# Altium project ArcadeTestHAT 05.PrjPCB (part 2 of 2)

## Sheet ArcadeTestHAT 05 Pi interface.SchDoc: R Pi interface circuitry
size A3; DrawnBy: Steve Hodges; DocumentNumber: 1; Revision: 1.2; SheetNumber: 1; SheetTotal: 2; VersionControl_RevNumber: 1
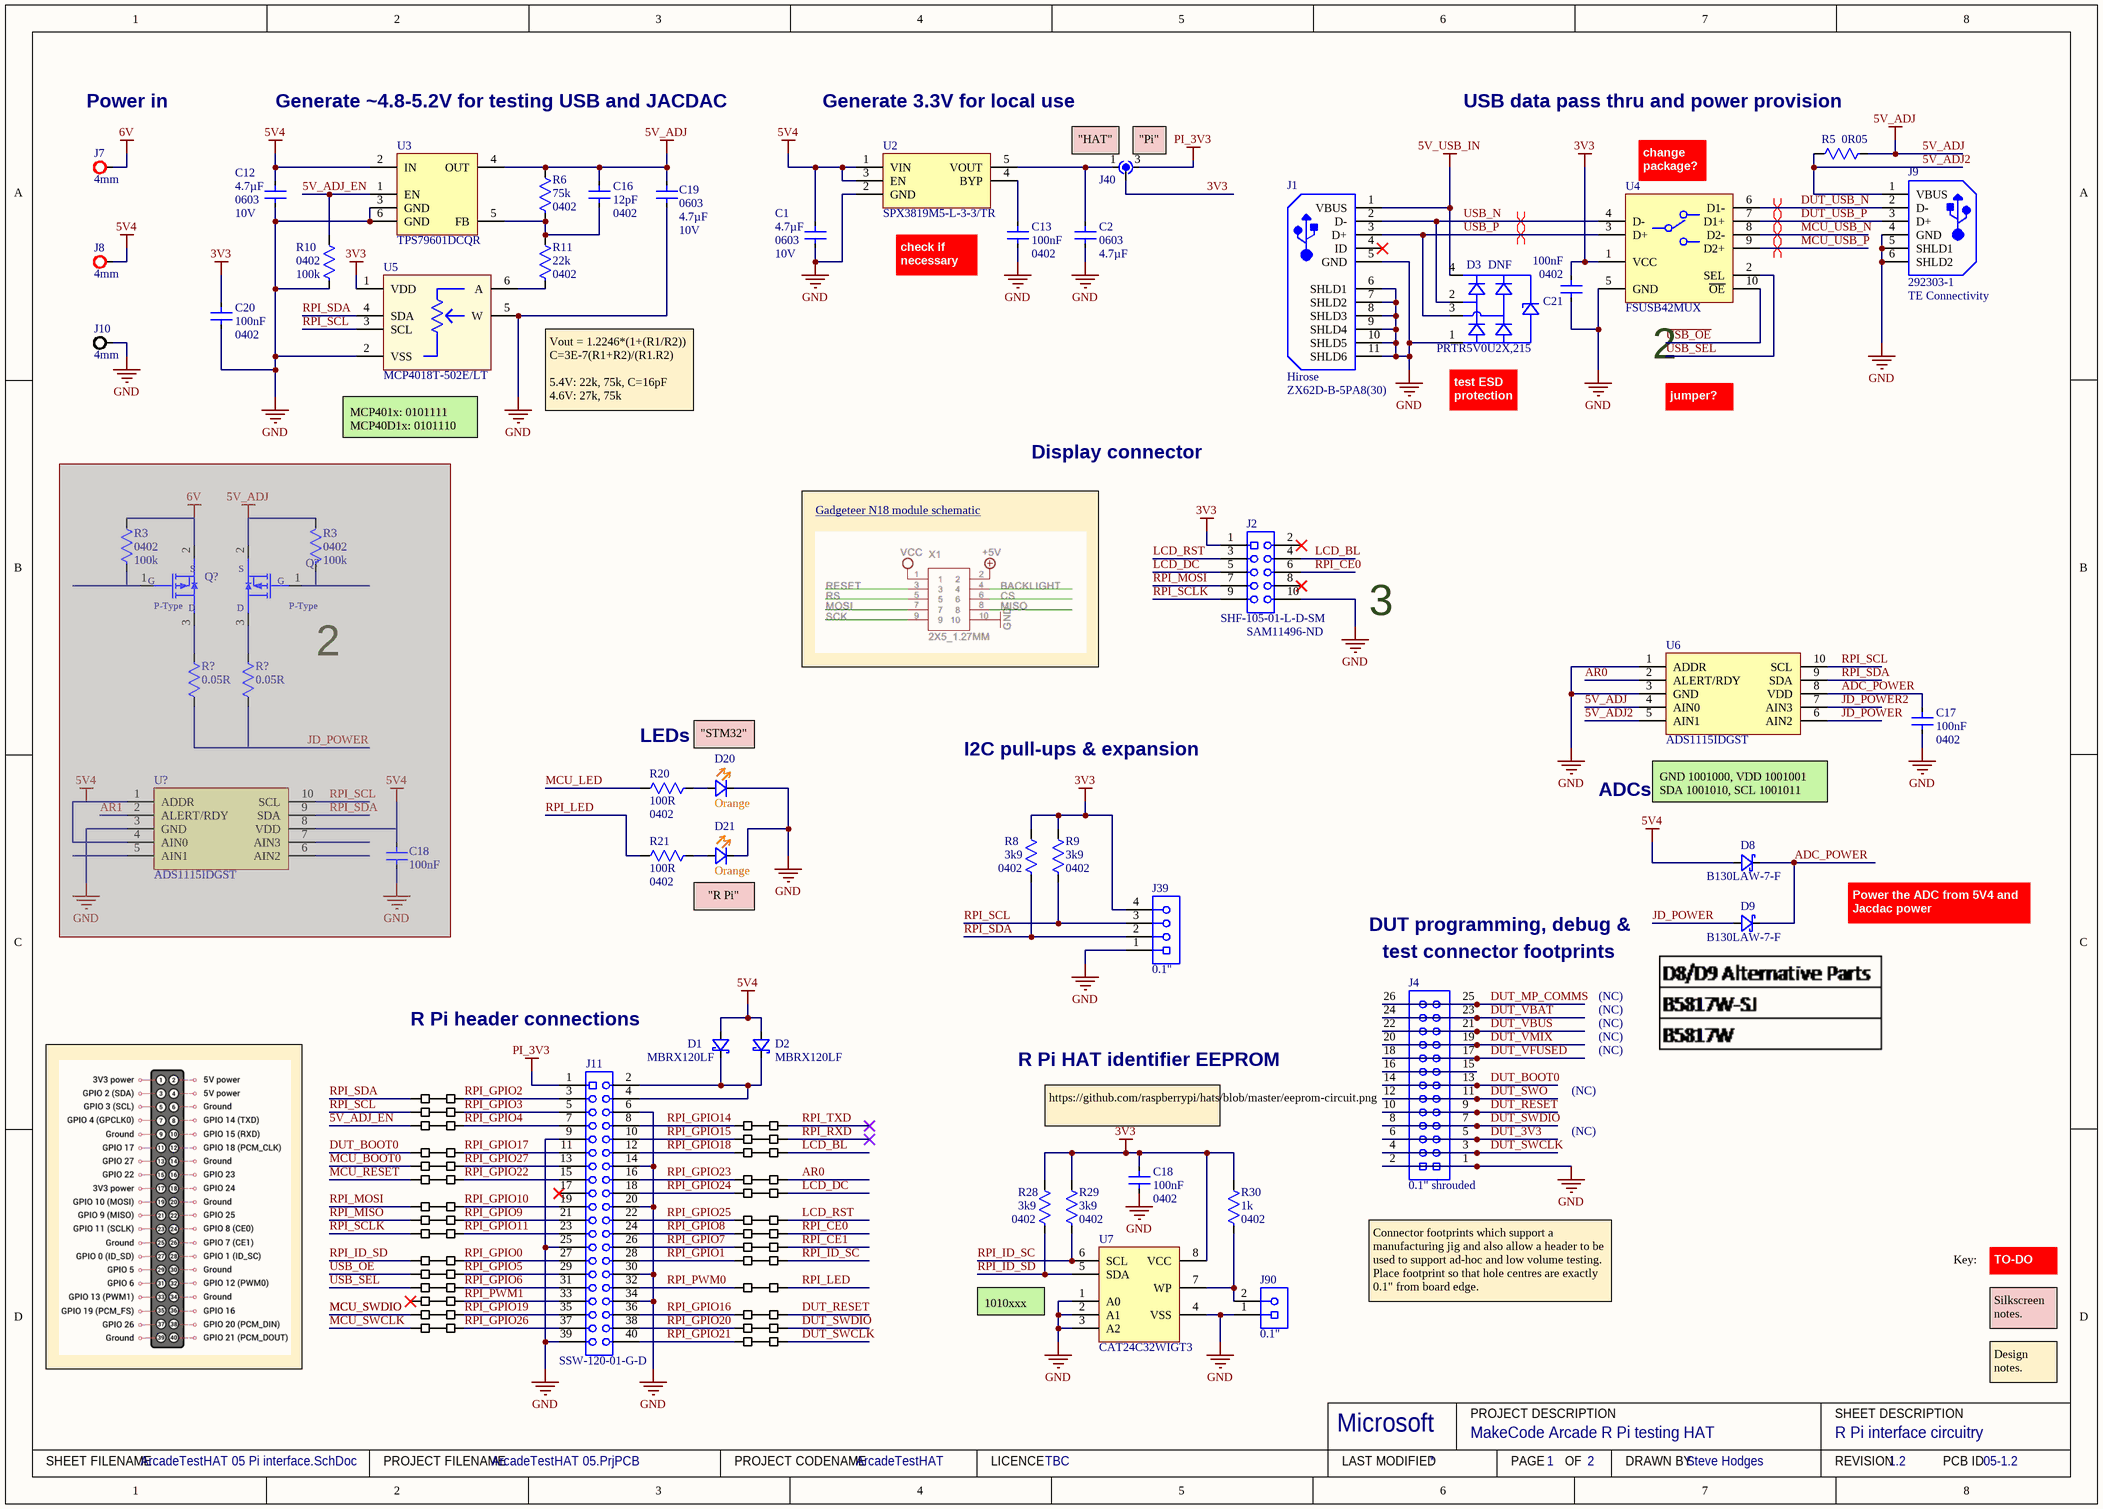
[diagram p1: ArcadeTestHAT 05 Pi interface.SchDoc]

### Parts
(Parts that share a designator on the sheet are numbered #1, #2 ... from top to bottom, then left to right.)
C1  Case/Package: 0603  Capacitance: 4.7µF  Voltage Rating: 10V  [CAP 0603 (1608) x 1.2mm]  (hidden comment: CL10A475KP8NNNC)
C2  Case/Package: 0603  Capacitance: 4.7µF  [CAP 0603 (1608) x 1.2mm]  (hidden comment: CL10A475KP8NNNC)
C12  Case/Package: 0603  Capacitance: 4.7µF  Voltage Rating: 10V  [CAP 0603 (1608) x 1.2mm]  (hidden comment: CL10A475KP8NNNC)
C13  Case/Package: 0402  Capacitance: 100nF  [CAP0402]  (hidden comment: 0402YG104ZAT2A)
C16  value 12pF  Package Size: 0402  [CAP0402]  (hidden comment: CAP0402_GENERIC 12pF)
C17  Case/Package: 0402  Capacitance: 100nF  [CAP0402]  (hidden comment: 0402YG104ZAT2A)
C18#1  100nF  [TDK 2010]  (masked out: inside a compile mask, not in the netlist)
C18#2  Case/Package: 0402  Capacitance: 100nF  [CAP0402]  (hidden comment: 0402YG104ZAT2A)
C19  Case/Package: 0603  Capacitance: 4.7µF  Voltage Rating: 10V  [CAP 0603 (1608) x 1.2mm]  (hidden comment: CL10A475KP8NNNC)
C20  Case/Package: 0402  Capacitance: 100nF  [CAP0402]  (hidden comment: 0402YG104ZAT2A)
C21  Case/Package: 0402  Capacitance: 100nF  [CAP0402]  (hidden comment: 0402YG104ZAT2A)
D1  MBRX120LF  [MCC SOD-123]
D2  MBRX120LF  [MCC SOD-123]
D3  DNF  Manufacturer Part Number: PRTR5V0U2X,215  [NXP-SOT143B-4_V]  (no BOM)
D8  B130LAW-7-F  [SOD-123]
D9  B130LAW-7-F  [SOD-123]
D20  Colour: Orange  [Rohm SML-D12 Orange]  (hidden comment: SML-D12D)
D21  Colour: Orange  [Rohm SML-D12 Orange]  (hidden comment: SML-D12D)
J1  Manufacturer: Hirose  Manufacturer Part Number: ZX62D-B-5PA8(30)  [HIRO-ZX62D-B-5PA8_V-noslots]  (hidden comment: ZX62D-B-5PA8(30)-whitesch)
J2  Manufacturer Part Number: SHF-105-01-L-D-SM  Supplier Part Number 6: SAM11496-ND  [Samtec SHF-105-01-L-D-SM - Updated silkscreen]  (hidden comment: SHF-105-01-L-D-SM-whitesch)
J4  0.1" shrouded  [Generic 2x13 2.54mm header shrouded - Alternative]
J5  0603-SHORT  [0603-WITH-SHORT]  (value not drawn)  (net tie, no BOM)
J7  4mm  [4mm post red]
J8  4mm  [4mm post red]
J9  Manufacturer Part Number: 292303-1  Manufacturer: TE Connectivity  [TE-292303-1_V - MH with enlarged annular ring]  (hidden comment: TE-292303)
J10  4mm  [4mm post black]
J11  SSW-120-01-G-D  [SAMTEC-SSW-120-01-G-D]
J12  0603-SHORT  [0603-WITH-SHORT]  (value not drawn)  (net tie, no BOM)
J13  0603-SHORT  [0603-WITH-SHORT]  (value not drawn)  (net tie, no BOM)
J14  0603-SHORT  [0603-WITH-SHORT]  (value not drawn)  (net tie, no BOM)
J15  0603-SHORT  [0603-WITH-SHORT]  (value not drawn)  (net tie, no BOM)
J16  0603-SHORT  [0603-WITH-SHORT]  (value not drawn)  (net tie, no BOM)
J17  0603-SHORT  [0603-WITH-SHORT]  (value not drawn)  (net tie, no BOM)
J18  0603-SHORT  [0603-WITH-SHORT]  (value not drawn)  (net tie, no BOM)
J19  0603-SHORT  [0603-WITH-SHORT]  (value not drawn)  (net tie, no BOM)
J20  0603-SHORT  [0603-WITH-SHORT]  (value not drawn)  (net tie, no BOM)
J21  0603-SHORT  [0603-WITH-SHORT]  (value not drawn)  (net tie, no BOM)
J22  0603-SHORT  [0603-WITH-SHORT]  (value not drawn)  (net tie, no BOM)
J23  0603-SHORT  [0603-WITH-SHORT]  (value not drawn)  (net tie, no BOM)
J24  0603-SHORT  [0603-WITH-SHORT]  (value not drawn)  (net tie, no BOM)
J25  0603-SHORT  [0603-WITH-SHORT]  (value not drawn)  (net tie, no BOM)
J26  0603-SHORT  [0603-WITH-SHORT]  (value not drawn)  (net tie, no BOM)
J27  0603-SHORT  [0603-WITH-SHORT]  (value not drawn)  (net tie, no BOM)
J28  0603-SHORT  [0603-WITH-SHORT]  (value not drawn)  (net tie, no BOM)
J29  0603-SHORT  [0603-WITH-SHORT]  (value not drawn)  (net tie, no BOM)
J30  0603-SHORT  [0603-WITH-SHORT]  (value not drawn)  (net tie, no BOM)
J31  0603-SHORT  [0603-WITH-SHORT]  (value not drawn)  (net tie, no BOM)
J32  0603-SHORT  [0603-WITH-SHORT]  (value not drawn)  (net tie, no BOM)
J33  0603-SHORT  [0603-WITH-SHORT]  (value not drawn)  (net tie, no BOM)
J34  0603-SHORT  [0603-WITH-SHORT]  (value not drawn)  (net tie, no BOM)
J35  0603-SHORT  [0603-WITH-SHORT]  (value not drawn)  (net tie, no BOM)
J36  0603-SHORT  [0603-WITH-SHORT]  (value not drawn)  (net tie, no BOM)
J37  0603-SHORT  [0603-WITH-SHORT]  (value not drawn)  (net tie, no BOM)
J38  0603-SHORT  [0603-WITH-SHORT]  (value not drawn)  (net tie, no BOM)
J39  0.1"  [Generic 1x4 2.54mm header]
J40  Three way open solder blob  [ThreeWaySolderBlob]  (value not drawn)  (no BOM)
J90  0.1"  [Generic 1x2 2.54mm header]
Q?#1  MOSFET P-CH 20V 4.2A SOT23  [DIODES-SOT23-3]  (value not drawn)  (masked out: inside a compile mask, not in the netlist)
Q?#2  MOSFET P-CH 20V 4.2A SOT23  [DIODES-SOT23-3]  (value not drawn)  (masked out: inside a compile mask, not in the netlist)
R3#2  Case Code (Imperial): 0402  Resistance: 100k  [RES0402]  (hidden comment: MCWR04X1003FTL)  (masked out: inside a compile mask, not in the netlist)
R3#3  Case Code (Imperial): 0402  Resistance: 100k  [RES0402]  (hidden comment: MCWR04X1003FTL)  (masked out: inside a compile mask, not in the netlist)
R5  value 0R05  [RES1206]  (hidden comment: KDV12FR050ET)
R6  Case: 0402  [RES0402]  (hidden comment: 75k)
R8  Case: 0402  [RES0402]  (hidden comment: 3k9)
R9  Case: 0402  [RES0402]  (hidden comment: 3k9)
R10  Case Code (Imperial): 0402  Resistance: 100k  [RES0402]  (hidden comment: MCWR04X1003FTL)
R11  Case: 0402  [RES0402]  (hidden comment: 22k)
R20  value 100R  Case: 0402  [RES0402]  (hidden comment: RES0402_GENERIC 100R)
R21  value 100R  Case: 0402  [RES0402]  (hidden comment: RES0402_GENERIC 100R)
R28  Case: 0402  [RES0402]  (hidden comment: 3k9)
R29  Case: 0402  [RES0402]  (hidden comment: 3k9)
R30  Case: 0402  [RES0402]  (hidden comment: 1k)
R?#3  value 0.05R  [RES1206]  (hidden comment: RES1206_GENERIC)  (masked out: inside a compile mask, not in the netlist)
R?#4  value 0.05R  [RES1206]  (hidden comment: RES1206_GENERIC)  (masked out: inside a compile mask, not in the netlist)
U2  Manufacturer Part Number: SPX3819M5-L-3-3/TR  [MaxLinear-SOT95P280X145-5N]  (hidden comment: SPX3819M5-L-3-3_TR)
U3  TPS79601DCQR  [TPS79633DCQR]
U4  FSUSB42MUX  [ON_SEMI-MSOP-10]
U5  MCP4018T-502E/LT  [MICROCHIP-SC70-6 - MAX]
U6  ADS1115IDGST  [ADS1115IDGST]
U7  Manufacturer Part Number: CAT24C32WIGT3  [ONSC-SOIC-8-751BD-01_L]  (hidden comment: CAT24C32WI-GT3)
U?  ADS1115IDGST  [ADS1115IDGST]  (masked out: inside a compile mask, not in the netlist)

### Nets
3V3: C18#2.2 C20.2 C21.2 J2.1 J39.4 J40.2 R8.1 R9.1 R28.1 R29.1 R30.1 U4.1(VCC) U5.1(VDD) U7.8(VCC)
5V4: C1.2 C12.2 D1.2(A) D2.2(A) D8.2(A) J8.1 U2.1(VIN) U2.3(EN) U3.2(IN)
5V_ADJ: C16.2 C19.2 R5.2 R6.1 U3.4(OUT) U6.4(AIN0)
5V_USB_IN: D3.4(VCC) J1.1(VBUS)
6V: J7.1
GND: C1.1 C2.1 C12.1 C13.1 C17.1 C18#2.1 C19.1 C20.1 C21.1 D3.1(GND) D20.1(K) D21.1(K) J1.5(GND) J1.6(SHLD1) J1.7(SHLD2) J1.8(SHLD3) J1.9(SHLD4) J1.10(SHLD5) J1.11(SHLD6) J2.10 J4.1 J4.2 J9.4(GND) J9.5(SHLD1) J9.6(SHLD2) J10.1 J11.6 J11.9 J11.14 J11.20 J11.25 J11.30 J11.34 J11.39 J39.1 J90.1 R10.2 U2.2(GND) U3.3(GND) U3.6(GND) U4.5(GND) U5.2(VSS) U5.5(W) U6.1(ADDR) U6.3(GND) U7.1(A0) U7.2(A1) U7.3(A2) U7.4(VSS)
PI_3V3: J11.1 J40.3
5V_ADJ2: J9.1(VBUS) R5.1 U6.5(AIN1)
5V_ADJ_EN: J13.2 R10.1 U3.1(EN)
~{USB_OE}: J30.2 U4.10(~{OE})
ADC_POWER: C17.2 D8.1(K) D9.1(K) U6.8(VDD)
AR0: J20.2 U6.2(ALERT/RDY)
DUT_3V3: J4.5 J4.6
DUT_BOOT0: J4.13 J4.14 J16.2
DUT_MP_COMMS: J4.25 J4.26
DUT_RESET: J4.9 J4.10 J35.2
DUT_SWCLK: J4.3 J4.4 J38.2
DUT_SWDIO: J4.7 J4.8 J37.2
DUT_SWO: J4.11 J4.12
DUT_USB_N: J9.2(D-) U4.6(D1-)
DUT_USB_P: J9.3(D+) U4.7(D1+)
DUT_VBAT: J4.23 J4.24
DUT_VBUS: J4.21 J4.22
DUT_VFUSED: J4.17 J4.18
DUT_VMIX: J4.19 J4.20
JD_POWER: D9.2(A) U6.6(AIN2)
JD_POWER2: U6.7(AIN3)
LCD_BL: J2.4 J17.2
LCD_DC: J2.5 J21.2
LCD_RST: J2.3 J24.2
MCU_BOOT0: J18.2
MCU_LED: R20.1
MCU_RESET: J19.2
MCU_SWCLK: J36.2
MCU_SWDIO: J34.2
MCU_USB_N: U4.8(D2-)
MCU_USB_P: U4.9(D2+)
RPI_CE0: J2.6 J26.2
RPI_CE1: J27.2
RPI_GPIO0: J11.27 J28.1
RPI_GPIO1: J11.28 J29.1
RPI_GPIO2: J5.1 J11.3
RPI_GPIO3: J11.5 J12.1
RPI_GPIO4: J11.7 J13.1
RPI_GPIO5: J11.29 J30.1
RPI_GPIO6: J11.31 J31.1
RPI_GPIO7: J11.26 J27.1
RPI_GPIO8: J11.24 J26.1
RPI_GPIO9: J11.21 J23.1
RPI_GPIO10: J11.19 J22.1
RPI_GPIO11: J11.23 J25.1
RPI_GPIO14: J11.8 J14.1
RPI_GPIO15: J11.10 J15.1
RPI_GPIO16: J11.36 J35.1
RPI_GPIO17: J11.11 J16.1
RPI_GPIO18: J11.12 J17.1
RPI_GPIO19: J11.35 J34.1
RPI_GPIO20: J11.38 J37.1
RPI_GPIO21: J11.40 J38.1
RPI_GPIO22: J11.15 J19.1
RPI_GPIO23: J11.16 J20.1
RPI_GPIO24: J11.18 J21.1
RPI_GPIO25: J11.22 J24.1
RPI_GPIO26: J11.37 J36.1
RPI_GPIO27: J11.13 J18.1
RPI_ID_SC: J29.2 R29.2 U7.6(SCL)
RPI_ID_SD: J28.2 R28.2 U7.5(SDA)
RPI_LED: J32.2 R21.1
RPI_MISO: J23.2
RPI_MOSI: J2.7 J22.2
RPI_PWM0: J11.32 J32.1
RPI_PWM1: J11.33 J33.1
RPI_RXD: J15.2
RPI_SCL: J12.2 J39.3 R9.2 U5.3(SCL) U6.10(SCL)
RPI_SCLK: J2.9 J25.2
RPI_SDA: J5.2 J39.2 R8.2 U5.4(SDA) U6.9(SDA)
RPI_TXD: J14.2
USB_N: D3.2(I/O1) J1.2(D-) U4.4(D-)
USB_P: D3.3(I/O2) J1.3(D+) U4.3(D+)
USB_SEL: J31.2 U4.2(SEL)
NetC2_2: C2.2 J40.1 U2.5(VOUT)
NetC13_2: C13.2 U2.4(BYP)
NetC16_1: C16.1 R6.2 R11.1 U3.5(FB)
NetD1_1: D1.1(K) D2.1(K) J11.2 J11.4
NetD20_2: D20.2(A) R20.2
NetD21_2: D21.2(A) R21.2
NetJ4_15: J4.15 J4.16
NetJ90_2: J90.2 R30.2 U7.7(WP)
NetR11_2: R11.2 U5.6(A)

Not connected (* = marked no-connect by the designer): J1 4(ID)*; J2 2* 8*; J11 17*; J33 2*

### Layout directives
differential pair: DUT_USB_N, DUT_USB_P, MCU_USB_N, MCU_USB_P, USB_N, USB_P

### Notes on the sheet
- Power in
- Generate ~4.8-5.2V for testing USB and JACDAC
- Generate 3.3V for local use
- (near R5) USB data pass thru and power provision
- (near J40) "HAT"
- (near J40) "Pi"
- (near U4) change package?
- check if necessary
- (near U4) 2
- (near U5) MCP401x: 0101111
  MCP40D1x: 0101110
- Vout = 1.2246*(1+(R1/R2))
  C=3E-7(R1+R2)/(R1.R2)
  5.4V: 22k, 75k, C=16pF
  4.6V: 27k, 75k
- (near D3) test ESD protection
- jumper?
- 5.2V: R2=22k, R1=71k, C=18pF
  4.4V: R2=27k, R1=71k
  4.8V: R2=22k, R1=64k, C=18pF
  5.2V: R2=30k, R1=98k, C=13pF
  4.8V: R2=30k, R1=87k, C=13pF
- Gadgeteer N18 module schematic <http://old.ghielectronics.com/downloads/schematic/Display_N18_Module_SCH.pdf>
- Display connector
- 3
- (near Q?#2) 2
- LEDs
- "STM32"
- I2C pull-ups & expansion
- ADCs
- GND 1001000, VDD 1001001
  SDA 1001010, SCL 1001011
- "R Pi"
- Power the ADC from 5V4 and Jacdac power
- DUT programming, debug &
- (near J4) test connector footprints
- R Pi header connections
- (NC)
- R Pi HAT identifier EEPROM
- https://github.com/raspberrypi/hats/blob/master/eeprom-circuit.png
- 1010xxx
- Connector footprints which support a manufacturing jig and also allow a header to be used to support ad-hoc and low volume testing. Place footprint so that hole centres are exactly 0.1" from board edge.
- Key:
- Silkscreen notes.
- TO-DO
- Design notes.
- Microsoft
- PROJECT DESCRIPTION
- SHEET DESCRIPTION
- SHEET FILENAME
- PROJECT FILENAME
- PROJECT CODENAME
- LICENCE
- LAST MODIFIED
- PAGE
- OF
- DRAWN BY
- REVISION
- PCB ID
- (in symbol DMG2305UX-whitesch) P-Type

### Library data of the parts
C1 C2 C12 C19 = 4.7uF 10V X5R ±10% Samsung CL: Generic 0603 capacitor 4.7uF 10V, e.g. Samsung CL10A475KP8NNNC; Dielectric: X5R; Tolerance: 10%; Created By: shodges; Supplier 1: Digi-Key; Manufacturer: Samsung; Manufacturer Part Number: CL10A475KP8NNNC; Stock 1: 40000; Pricing 1: 1=0.15, 10=0.109, 100=0.0513, 500=0.036, 1000=0.0298 (USD); Mount: Surface Mount; Case Code (Imperial): 0603; Contact Plating: Tin; Min Operating Temperature: -55°C; Max Operating Temperature: 85°C; Package Quantity: 1; Packaging: Tape and Reel; Length: 1.6mm; Height: 0.8mm; Width: 0.031inch; Thickness: 0.035inch; Depth: 0.8mm; Radiation Hardening: No; Supplier Part Number 1: 1276-1044-1-ND; Supplier 2: Farnell; Supplier Part Number 2: 3010071; Case Code (Metric): 1608
  C2: Voltage Rating: 10V
C13 C17 C18#2 C20 C21 = 0402YG104ZAT2A: Generic 0402 capacitor 100nF 16V, e.g. AVX 0402YG104ZAT2A; Manufacturer: Kyocera AVX; Tolerance: 80%; Dielectric: Y5V; Insulation Resistance: 100GR; Dissipation Factor: 9%; Supplier 1: Digi-Key; Manufacturer Part Number: 0402YG104ZAT2A; Stock 1: 0; Pricing 1: 1=0.1, 10=0.041, 100=0.0183, 500=0.01306, 1000=0.01026, 2500=0.00933, 5000=0.00858 (USD); Mount: Surface Mount,PCB; Case Code (Metric): 1005; Case Code (Imperial): 0402; Contact Plating: Tin,Matte; Min Operating Temperature: -30°C; Max Operating Temperature: 85°C; Packaging: Tape and Reel; Voltage Rating (DC): 16V; Termination: SMD/SMT; Voltage: 16V; Package Quantity: 1; Voltage Rating: 16V; Length: 1mm; Height: 0.5mm; Depth: 0.5mm; Width: 0.02inch; Thickness: 0.022inch; Radiation Hardening: No; REACH SVHC: No SVHC; Lead Free: Lead Free; ComponentLink2URL: http://datasheets.avx.com/Y5V.pdf; ComponentLink2Description: AVX datasheet online; Supplier 2: Farnell; Supplier 3: Mouser; Supplier 4: RSComponents; Supplier Part Number 1: 478-1138-1-ND; Supplier Part Number 2: 1327667; Supplier Part Number 3: 581-040216G104Z; Supplier Part Number 4: 698-3190
C16 = CAP0402_GENERIC: Generic 0402 capacitor 12pF; Rated Voltage: * V; Manufacturer: Generic
C18#1 = 100nF 0201 10V: CAP CER 0.1UF 10V X5R 0201; Manufacturer: TDK Corporation; Manufacturer Part Number: C0603X5R1A104K030BC; Capacitance: 0.10µF; Tolerance: ±10%; Supplier 1: Digi-Key; RoHS: RoHS Compliant; Category: Capacitors; Stock 1: 6306784; Pricing 1: 1=0.07, 10=0.034, 100=0.0157, 250=0.01288, 500=0.01102, 1000=0.00858, 5000=0.00715 (GBP); Packaging: Cut Tape (CT); Voltage - Rated: 10V; Temperature Coefficient: X5R; Mounting Type: Surface Mount, MLCC; Operating Temperature: -55°C ~ 85°C; Applications: General Purpose; Ratings: -; Package / Case: 0201 (0603 Metric); Size / Dimension: 0.024" L x 0.012" W (0.60mm x 0.30mm); Height - Seated (Max): -; Thickness (Max): 0.013" (0.33mm); Lead Spacing: -; Features: Low ESL; Lead Style: -; ComponentLink1URL: https://product.tdk.com/info/en/catalog/datasheets/mlcc_commercial_general_en.pdf; ComponentLink1Description: https://product.tdk.com/info/en/catalog/datasheets/mlcc_commercial_general_en.pdf; Supplier Part Number 1: 445-7318-1-ND
D1 D2 = MCC MBRX120LF: Schottky diode, 1A low Vf; Manufacturer: MCC; Manufacturer Part Number: MBRX120LF-TP; Forward Voltage: 360mV; Max Repetitive Reverse Voltage (Vrrm): 20V; Max Forward Surge Current (Ifsm): 12A; Element Configuration: Single; Max Power Dissipation: 556mW; Supplier 1: Digi-Key; Stock 1: 67630; Pricing 1: 1=0.51, 10=0.362, 100=0.2379, 500=0.1406, 1000=0.10815 (USD); Mount: Surface Mount; Number of Pins: 2; Min Operating Temperature: -65°C; Max Operating Temperature: 125°C; Packaging: Tape and Reel; Package Quantity: 1; Average Rectified Current: 1A; Forward Current: 1A; Peak Non-Repetitive Surge Current: 12A; Max Reverse Voltage (DC): 20V; Max Surge Current: 12A; Radiation Hardening: No; Lead Free: Lead Free; REACH SVHC: Unknown; Supplier 2: Farnell; Supplier 3: Mouser; ComponentLink1Description: MCC datasheet; ComponentLink1URL: http://www.mccsemi.com/up_pdf/MBRX120LF(SOD-123).pdf; Supplier Part Number 3: 833-MBRX120LF-TP; Supplier Part Number 1: MBRX120LF-TPMSCT-ND; Supplier Part Number 2: 1924371
D3 = NXP-PRTR5V0U2X,215-4-whitesch: USB TVS and ESD protection diodes; Manufacturer: NXP Semiconductors; Capacitance: 16pF; Breakdown Voltage: 6V; Direction: Unidirectional; Number of Channels: 2; Number of Elements: 1; Polarity: Bidirectional,Unidirectional; Working Voltage: 5.5V; Power Line Protection: Yes; Leakage Current: 100nA; Max Breakdown Voltage: 9V; Max Reverse Leakage Current: 100uA; Supplier 1: Digi-Key; Stock 1: 109808; Pricing 1: 1=0.55, 10=0.47, 100=0.3507, 500=0.27552, 1000=0.2129 (USD); Mount: Surface Mount; Case/Package: SOT; Number of Pins: 4; Weight: 0.001lb; Contact Plating: Tin; Min Operating Temperature: -40°C; Max Operating Temperature: 85°C; Packaging: Tape and Reel; Termination: SMD/SMT; Reverse Breakdown Voltage: 6V; Package Quantity: 1; Number of Bidirectional Channels: 2; Reverse Standoff Voltage: 5.5V; Min Breakdown Voltage: 6V; ESD Protection: Yes; Length: 3mm; Height: 1.1mm; Width: 1.4mm; Depth: 1.4mm; Radiation Hardening: No; REACH SVHC: No SVHC; Lead Free: Lead Free; ComponentLink8URL: http://www.farnell.com/datasheets/109718.pdf?src-supplier=Farnell; ComponentLink8Description: NXP datasheet; Supplier 2: Farnell; Supplier 3: RSComponents; Supplier 4: Mouser; Supplier Part Number 4: 771-PRTR5V0U2X-T/R; Supplier Part Number 3: 725-8720; Supplier Part Number 2: 2371119; Supplier Part Number 1: 1727-3884-1-ND
D8 D9 = B130LAW-7-F: Diode Schottky 30V 1A 2-Pin SOD-123 T/R; Manufacturer: Diodes; Max Reverse Current: 1mA; Peak Non-Repetitive Surge Current: 12A; Element Configuration: Single; Forward Voltage: 420mV; Polarity: Standard; Capacitance: 40pF; Supplier 1: Digi-Key; RoHS: Yes; Category: Schottky Diodes; Stock 1: 89617; Pricing 1: 1=0.53000, 10=0.39600, 100=0.24660, 500=0.16874, 1000=0.12980 (USD); Mount: Surface Mount; Number of Pins: 2; Weight: 0.000353oz; Contact Plating: Tin,Matte; Min Operating Temperature: -55°C; Max Operating Temperature: 125°C; Forward Current: 1A; Max Repetitive Reverse Voltage (Vrrm): 30V; Package Quantity: 3000; Packaging: Tape and Reel; Average Rectified Current: 1A; Max Forward Surge Current (Ifsm): 12A; Termination: SMD/SMT; Voltage Rating (DC): 30V; Current Rating: 1A; Output Current: 1A; Max Reverse Voltage (DC): 30V; Series: -; Length: 2.85mm; Width: 1.7mm; Height: 1.25mm; Radiation Hardening: No; REACH SVHC: No SVHC; Lead Free: Lead Free; RoHS Compliant: Yes; ComponentLink1URL: https://datasheet.ciiva.com/913/ds30308-913553.pdf; ComponentLink1Description: Online datasheet; Supplier 2: Farnell; Stock 2: 4962; Pricing 2: 5=0.45100, 10=0.30700, 100=0.14600, 500=0.12800, 1000=0.08580, 5000=0.07590 (GBP); Supplier 3: RSComponents; Stock 3: 3525; Pricing 3: 25=0.33300, 150=0.20600, 750=0.16500, 1500=0.12100 (USD); Supplier Part Number 3: 7513193P; Supplier Part Number 2: 1858617; Supplier Part Number 1: B130LAW-FDICT-ND; Created By: D. Gakure; Checked By: ?; Manufacturer Part Number: B130LAW-7-F
D20 D21 = SML-D12D: 1.6 x 0.8 x 0.55mm (0603) LED 605nm Orange; Manufacturer: Rohm Semiconductor; Manufacturer Part Number: SML-D12D8WT86; Millicandela Rating: 100mcd; Voltage - Forward (Vf) (Typ): 2.2V; Current - Test: 20mA; Lens Type: Diffused, White; Lens Style/Size: Rectangle with Flat Top, 1.2mm x 0.8mm; Supplier 1: Digi-Key; RoHS: RoHS Compliant; Category: Optoelectronics; Stock 1: 1719; Pricing 1: 1=0.38, 10=0.279, 25=0.2232, 100=0.1478, 250=0.1046, 500=0.08926, 1000=0.06974 (GBP); Packaging: Cut Tape (CT); Wavelength - Dominant: 605nm; Wavelength - Peak: -; Viewing Angle: -; Package / Case: 0603 (1608 Metric); Size / Dimension: 1.60mm L x 0.80mm W; Height: 0.55mm; Mounting Type: Surface Mount; Luminous Flux @ Current - Test: -; ComponentLink1URL: http://rohmfs.rohm.com/en/products/databook/datasheet/opto/led/chip_mono/sml-d1.pdf; ComponentLink1Description: http://rohmfs.rohm.com/en/products/databook/datasheet/opto/led/chip_mono/sml-d1.pdf; Supplier Part Number 1: 511-1577-1-ND
J1 = ZX62D-B-5PA8(30)-whitesch: Micro USB SMD with TH mechanical mount; Number of Contacts: 5; Gender: Receptacle; USB Standard: USB 2.0; Supplier 1: Digi-Key; Stock 1: 12999; Pricing 1: 1=0.77, 10=0.726, 25=0.6536, 50=0.5808, 100=0.5566, 250=0.5082, 500=0.484, 1000=0.3993 (USD); Mount: Surface Mount,Horizontal; Number of Pins: 5; Contact Material: Copper Alloy; Contact Plating: Gold; Packaging: Tape and Reel; Connector Type: USB; Orientation: Right Angle; REACH SVHC: Unknown; Lead Free: Lead Free; Supplier 2: Farnell; Supplier 3: Mouser; Supplier 4: RSComponents; Supplier Part Number 1: H125718CT-ND; Supplier Part Number 2: 2554981; Supplier Part Number 3: 798-ZX62D-B-5PA830; Supplier Part Number 4: 1360893; ComponentLink1Description: datasheet; ComponentLink1URL: Y:\System\Altium\Libraries 2014\Hirose\Datasheets\Hirose-ZX.pdf
J2 = SHF-105-01-L-D-SM-whitesch: Standard Card Edge Connectors .050 Mini Edge Card Connector, Vertical; Manufacturer: Samtec; Number of Contacts: 10; Gender: Male; Pitch: 1.27mm; Supplier 1: Samtec; Supplier Part Number 1: SHF-105-01-L-D-SM; ComponentLink1Description: samtec datasheet online; ComponentLink1URL: http://www.farnell.com/datasheets/1927736.pdf?src-supplier=Avnet; ComponentLink2Description: samtec datasheet; ComponentLink2URL: Y:\System\Altium\Libraries 2014\Samtec; Supplier 2: Digi-Key; Stock 2: 9740; Pricing 2: 1=2.98, 45=2.618, 135=2.38, 540=2.023, 1035=1.7255, 5040=1.547 (USD); Contact Plating: Gold; Contact Material: Bronze; Housing Color: Black; Housing Material: Polymer; Min Operating Temperature: -55°C; Max Operating Temperature: 125°C; Packaging: Bulk; Number of Rows: 2; Termination: Solder; Orientation: Straight; Length: 12.7mm; Depth: 5.59mm; Radiation Hardening: No; REACH SVHC: No SVHC; Supplier 3: Farnell; Supplier 4: Mouser; Supplier 5: RSComponents; Supplier Part Number 2: SAM10710-ND; Supplier Part Number 3: 1885915; Supplier Part Number 4: 200-SHF10501LDSM; Supplier Part Number 5: 9011854; Supplier 6: Digi-Key; RoHS: Yes; Category: Card Edge Connectors; Stock 6: 49; Pricing 6: 1=4.53000, 10=4.34400, 25=3.98200, 50=3.80100, 100=3.62000, 250=3.16752, 500=3.07700, 1000=2.62450, 2500=2.44350 (USD); Mount: Surface Mount; ComponentLink3URL: https://datasheet.ciiva.com/10926/mecf-10926311.pdf?src-supplier=Avnet; ComponentLink3Description: https://datasheet.ciiva.com/10926/mecf-10926311.pdf?src-supplier=Avnet; ComponentLink4URL: https://datasheet.ciiva.com/16666/mecf-16666423.pdf?src-supplier=Avnet+Europe; ComponentLink4Description: https://datasheet.ciiva.com/16666/mecf-16666423.pdf?src-supplier=Avnet+Europe
J4 = Header Multicomp MC-254-26-00-ST-DIP-whitesch: 2.54mm, 13x2 way, vertical, TH, square pin, gold plate, shroud; ComponentLink1URL: http://www.farnell.com/datasheets/2602723.pdf?src-supplier=Farnell; ComponentLink1Description: multicomp datasheet; Supplier 1: Farnell; Manufacturer: Multicomp; Manufacturer Part Number: MC-254-26-00-ST-DIP; Stock 1: 10849; Pricing 1: 5=0.29600, 50=0.21800, 150=0.18900, 250=0.15400, 500=0.14900, 1500=0.14300, 2500=0.13800, 5000=0.13200 (GBP); RoHS: No; Supplier Part Number 1: 2843533
J5 J12-J38 = 0603-SHORT: Power: *mW; Value: *R; Package Size: 0603
J7 J8 = 4mm post red: panel/PCB mount 4mm connector terminal, red; Manufacturer: Multicomp; Manufacturer Part Number: 24.247.1; Current Rating: 32A; Voltage Rating: 30V; Gender: Female; ComponentLink1Description: multicomp drawing online; ComponentLink1URL: http://www.farnell.com/datasheets/1901212.pdf?_ga=2.153323963.2000810948.1575820374-240913015.1522930266&_gac=1.204614052.1572628993.EAIaIQobChMI_-yFp8PJ5QIVFODtCh02OgyTEAQYASABEgKDRPD_BwE; ComponentLink2Description: multicomp datasheet online; ComponentLink2URL: http://www.farnell.com/datasheets/2632229.pdf?_ga=2.128402447.2000810948.1575820374-240913015.1522930266&_gac=1.253370685.1572628993.EAIaIQobChMI_-yFp8PJ5QIVFODtCh02OgyTEAQYASABEgKDRPD_BwE; Supplier 1: Farnell; Stock 1: 27137; Pricing 1: 1=0.48600, 10=0.45800, 25=0.43900 (GBP); RoHS: Yes; Contact Plating: Nickel; Contact Material: Brass; Termination: Solder; Voltage Rating (DC): 30V; Length: 22.8mm; REACH SVHC: No SVHC; Supplier Part Number 1: 1698950
J9 = TE-292303: USB 2.0 type A socket, TH; Plating: Bright,Tin; Connector Type: Receptacle; Number of Positions: 4; Number of Ports: 1; Current Rating: 1A; Plating Thickness: 0.76um; Circuit Application: Signal; Connector System: Cable-to-Board; Insulation Resistance: 1GR; USB Standard: USB 2.0; Voltage Rating (AC): 30V; Pitch: 2.5mm; PCB Thickness: 0.062inch; Tail Length: 0.112inch; Approvals: UL; Supplier 1: Digi-Key; Stock 1: 36943; Pricing 1: 1=1.31000, 10=1.15100, 25=1.08320, 50=1.03800, 100=0.99290, 250=0.90268, 500=0.81242, 1000=0.72214, 2500=0.65444 (USD); RoHS: Yes; Mount: Through Hole,Horizontal; Contact Plating: Nickel,Gold; Housing Material: Thermoplastic; Housing Color: Black; Contact Material: Copper Alloy,Copper; Color: Black; Number of Terminals: 4; Min Operating Temperature: -67°C; Max Operating Temperature: 185°C; Package Quantity: 30; Termination: Through Hole; Packaging: Rail/Tube; Number of Contacts: 4; Orientation: Right Angle; Gender: Receptacle; Contact Current Rating: 1A; Length: 14.63mm; Depth: 14mm; Flammability Rating: UL94 V-0; Halogen Free: Halogen Free; REACH SVHC: No SVHC; Supplier 2: Farnell; Supplier 3: Mouser; Supplier 4: RSComponents; ComponentLink1Description: datasheet online; ComponentLink1URL: https://www.te.com/commerce/DocumentDelivery/DDEController?Action=showdoc&DocId=Customer+Drawing%7F292303%7FE13%7Fpdf%7FEnglish%7FENG_CD_292303_E13.pdf%7F292303-1; Supplier Part Number 1: A31726-ND; Supplier Part Number 2: 1076663; Supplier Part Number 3: 571-292303-1; Supplier Part Number 4: 5298195P
J10 = 4mm post black: panel/PCB mount 4mm connector terminal, black; Manufacturer: Multicomp; Manufacturer Part Number: 24.247.2; Current Rating: 32A; Gender: Receptacle; Voltage Rating (DC): 30V; Supplier 1: Farnell; Stock 1: 13568; Pricing 1: 1=0.45500, 10=0.43000, 25=0.41700 (GBP); RoHS: Yes; Contact Plating: Nickel; Contact Material: Brass; Termination: Solder; Length: 22.8mm; REACH SVHC: No SVHC; ComponentLink1Description: multicomp drawaing online; ComponentLink1URL: http://www.farnell.com/datasheets/1901212.pdf?_ga=2.153323963.2000810948.1575820374-240913015.1522930266&_gac=1.204614052.1572628993.EAIaIQobChMI_-yFp8PJ5QIVFODtCh02OgyTEAQYASABEgKDRPD_BwE; ComponentLink2Description: multicomp datasheet online; ComponentLink2URL: http://www.farnell.com/datasheets/2632229.pdf?_ga=2.128402447.2000810948.1575820374-240913015.1522930266&_gac=1.253370685.1572628993.EAIaIQobChMI_-yFp8PJ5QIVFODtCh02OgyTEAQYASABEgKDRPD_BwE; Supplier Part Number 1: 1698951
J11 = SSW-120-01-G-D: 20 position 2 row (40 way) 0.1" TH socket; Manufacturer: Samtec; Number of Contacts: 40; Gender: Receptacle; Connector Type: Receptacle,Socket; Contact Resistance: 10mR; Max Current Rating: 6.9A; Max Voltage Rating (AC): 550V; Mating Cycles: 100; Pitch: 2.54mm; Row Spacing: 0.1inch; ComponentLink1Description: samtec catalogue page online; ComponentLink1URL: http://suddendocs.samtec.com/catalog_english/ssw_th.pdf; ComponentLink2Description: samtec drawing online; ComponentLink2URL: http://suddendocs.samtec.com/prints/ssw-1xx-xx-xxx-x-xx-xxx-xx-mkt.pdf; Supplier 1: Digi-Key; Manufacturer Part Number: SSW-120-01-G-D; Stock 1: 0; Pricing 1: 1=5.36000, 10=5.14900, 25=4.72040, 50=4.50580, 100=4.29120, 250=3.75480, 500=3.64752 (USD); RoHS: Yes; Mount: Through Hole; Contact Plating: Gold; Color: Black; Contact Material: Bronze; Housing Color: Black; Housing Material: Polymer; Min Operating Temperature: -55°C; Max Operating Temperature: 125°C; Number of Rows: 2; Termination: Solder; Packaging: Bulk; Number of Positions: 40; Orientation: Straight; Current Rating: 6.9A; Voltage Rating: 550V; Length: 51.31mm; Depth: 4.95mm; Lead Pitch: 2.54mm; Radiation Hardening: No; Lead Free: Lead Free; REACH SVHC: No SVHC; Supplier 2: Farnell; Supplier 3: Mouser; Supplier 4: RSComponents; Supplier Part Number 1: SAM1208-20-ND; Supplier Part Number 2: 1668397; Supplier Part Number 3: 200-SSW12001GD; Supplier Part Number 4: 7655802
J39 = Header Multicomp 2211S-04G-whitesch: 2.54mm, 4x1 way, vertical, square pin, gold plate; Pitch Spacing: 2.54; No. of Contacts: 4; Gender: Header; Product Range: 2211; Contact Termination Type: Through Hole; No. of Rows: 1; SVHC: No SVHC (17-Dec-2015); Contact Resistance: 20; Contact Termination: Solder; Current Rating: 3; Insulation Resistance: 1000; Voltage Rating V AC: 250; Withstand Voltage: 600V<!--FANDB--><div class="features-and-benefits-container"><div class="features-and-benefits-description"><span class="features-benefits-value">The 2211S-04G is a 4-pin 1-row PCB Header with gold plated copper alloy contacts and a black high temperature plastic (PBT) insulator. This board-to-board holder is ideal for through hole vertical mounting.</span></div><div class="features-and-benefits-list"><ul class="features-and-benefits-list-list"><li class="features-and-benefits-list-item">3A AC/DC Rated current</li><li class="features-and-benefits-list-item">250VAC/DC Rated voltage</li><li class="features-and-benefits-list-item">20; Created By: HUGHWI; Supplier 1: Farnell; Manufacturer: Multicomp; Manufacturer Part Number: 2211S-04G; RoHS: YES; Stock 1: 2760; Pricing 1: 1=0.0973, 5=0.0918, 25=0.0864, 50=0.0808, 100=0.0753, 250=0.032 (GBP); Contact Plating: Gold Plated Contacts; Contact Material: Copper Alloy; Flammability Rating: UL94V-0; Lead Spacing: 2.54; Operating Temperature Max: 105; Operating Temperature Min: -40; Termination Method: Solder; ComponentLink1URL: http://www.farnell.com/datasheets/1518407.pdf; ComponentLink1Description: header strip datasheet; Supplier Part Number 1: 1593413
J40 = ThreeWaySolderBlob
J90 = Header Multicomp 2211S-02G-whitesch: 2.54mm, 2x1 way, vertical, square pin, gold plate; Created By: daclethe; Supplier 1: Farnell; Manufacturer: Multicomp; Manufacturer Part Number: 2211S-02G; RoHS: YES; Stock 1: 168174; Pricing 1: 100=0.0203, 500=0.0146, 1000=0.0122, 2500=0.011, 5000=0.0099, 10000=0.0086 (GBP); ComponentLink1URL: http://www.farnell.com/datasheets/1518407.pdf; ComponentLink1Description: header strip datasheet; Supplier Part Number 1: 1593411
Q?#1 Q?#2 = DMG2305UX-whitesch: Manufacturer: Diodes; Manufacturer Part Number: DMG2305UX-13; Rise Time: 13.7ns; Rds On Max: 52mR; Input Capacitance: 808pF; Max Power Dissipation: 1.4W; Turn-On Delay Time: 10.8ns; Turn-Off Delay Time: 79.3ns; Fall Time: 34.7ns; Threshold Voltage: -900mV; Element Configuration: Single; Gate to Source Voltage (Vgs): 8V; Number of Channels: 1; Drain to Source Breakdown Voltage: -20V; On-State Resistance: 65MR; Supplier 1: Digi-Key; Stock 1: 131638; Pricing 1: 1=0.44, 10=0.398, 100=0.2228, 500=0.1194, 1000=0.0812 (USD); Mount: Surface Mount; Case/Package: TO-236-3; Number of Pins: 3; Weight: 0.000282oz; Min Operating Temperature: -55°C; Max Operating Temperature: 150°C; Package Quantity: 1; Packaging: Tape and Reel; Continuous Drain Current (ID): 4.2A; Drain to Source Voltage (Vdss): 20V; Drain to Source Resistance: 52mR; Length: 3mm; Height: 1.1mm; Width: 1.4mm; Radiation Hardening: No; REACH SVHC: No SVHC; Lead Free: Lead Free; ComponentLink2URL: https://datasheet.ciiva.com/18566/dmg2305ux-18566951.pdf; ComponentLink2Description: online datasheet; Supplier Part Number 1: DMG2305UX-13DICT-ND; ComponentLink3Description: datasheet; ComponentLink3URL: Y:\System\Altium\Libraries 2014\Diodes Inc\Datasheets\dmg2305ux-30023840.pdf; Supplier 2: Farnell; Supplier 3: Mouser; Supplier 4: RSComponents; Supplier Part Number 2: 2543533; Supplier Part Number 3: 621-DMG2305UX-7; Supplier Part Number 4: 8270452
R3#2 R3#3 R10 = MCWR04X1003FTL: Generic 0402 resistor 100k, e.g. Multicomp MCWR04X1003FTL; Power Rating: 62.5mW; Tolerance: 1%; Voltage Rating: 50V; Temperature Coefficient: 100ppm/°C; Supplier 1: Farnell; Manufacturer: Multicomp; Manufacturer Part Number: MCWR04X1003FTL; Stock 1: 414470; Pricing 1: 10=0.0041, 100=0.0025, 500=0.0018, 2500=0.0014, 5000=0.0011 (GBP); Mount: Surface Mount; Case/Package: 0402; Case Code (Metric): 1005; Packaging: Cut Tape; Composition: Thick Film; Voltage Rating (DC): 50V; REACH SVHC: No SVHC; ComponentLink1URL: http://www.farnell.com/datasheets/1849611.pdf?src-supplier=Element14; ComponentLink1Description: Multicomp datasheet online; Supplier Part Number 1: 2447094; ComponentLink2Description: datasheet; ComponentLink2URL: Y:\System\Altium\Libraries 2014\Multicomp\datasheets\thick film chip resistors 1849611.pdf
R5 = KDV12FR050ET: Generic 1206 resistor 0.05R 1% 0.5W, e.g. Ohmite KDV12FR050ET; Power: 500mW; Supplier 1: Digi-Key; Manufacturer: Ohmite; Manufacturer Part Number: KDV12FR050ET; Stock 1: 4924; Pricing 1: 1=0.29000, 10=0.24200, 25=0.17600, 50=0.12760, 100=0.09460, 250=0.07260, 500=0.05720, 1000=0.03960 (USD); Supplier 2: Farnell; Supplier 3: Mouser; Supplier Part Number 1: 273-KDV12FR050ETCT-ND; Supplier Part Number 2: 3273730; Supplier Part Number 3: 588-KDV12FR050ET; ComponentLink1Description: Ohmite datasheet online; ComponentLink1URL: https://www.ohmite.com/assets/docs/res_kdv.pdf; Tolerance: 1%; Package Size: 1206
R6 = RES0402_GENERIC: Generic 0402 Chip Resistor 75k; Value: 75k; Manufacturer: Generic
R8 R9 R28 R29 = RES0402_GENERIC: Generic 0402 resistor 3k9; Value: 3k9; Manufacturer: Generic
R11 = RES0402_GENERIC: Generic 0402 resistor 22k; Value: 22k; Manufacturer: Generic
R20 R21 = RES0402_GENERIC: Generic 0402 resistor 100R; Manufacturer: Generic
R30 = RES0402_GENERIC: Generic 0402 resistor 1k; Value: 1k; Manufacturer: Generic
R?#3 R?#4 = RES1206_GENERIC: RES generic 1206 SMD; Power: *mW; Package Size: 1206
U2 = SPX3819M5-L-3-3_TR: 3.3V LDO; Manufacturer: Exar; Dropout Voltage: 340mV; Number of Outputs: 1; Min Input Voltage: 2.5V; Output Current: 500mA; Max Input Voltage: 16V; Polarity: Positive; Quiescent Current: 3uA; Accuracy: 1%; Output Type: Fixed; Supplier 1: Digi-Key; Stock 1: 72378; Pricing 1: 1=0.57, 10=0.479, 25=0.4196, 100=0.3595, 250=0.3116, 500=0.26364, 1000=0.20373 (USD); Mount: Surface Mount; Case/Package: SOT-23-5; Number of Pins: 5; Min Operating Temperature: -40°C; Max Operating Temperature: 125°C; Output Voltage: 3.3V; Packaging: Tape and Reel; Max Output Current: 500mA; Number of Regulators: 1; Min Output Voltage: 3.3V; Output Voltage Accuracy: 1%; Length: 2.9mm; Height: 1.3mm; Width: 1.6mm; Radiation Hardening: No; Lead Free: Lead Free; Supplier 2: Farnell; Supplier 3: Mouser; Supplier 4: RSComponents; Supplier Part Number 1: 1016-1873-1-ND; Supplier Part Number 2: 2889625; Supplier Part Number 3: 701-SPX3819M5-L-33TR; Supplier Part Number 4: 8472888; ComponentLink3Description: MaxLinear datasheet online; ComponentLink3URL: https://www.maxlinear.com/ds/spx3819.pdf; ComponentLink4Description: Maxlinear datasheet; ComponentLink4URL: Y:\System\Altium\Libraries 2014\MaxLinear (was Exar)\datasheets\SPX3819.pdf
U3 = TPS79601DCQR: IC REG LDO adj1A SOT223-6; Manufacturer: Texas Instruments; Dropout Voltage: 200mV; Output Current: 1A; Number of Outputs: 1; Output Voltage: 5.5V; Min Input Voltage: 2.7V; Min Current Limit: 2.4A; Input Bias Current: 265uA; Reference Voltage: 1.225V; Min Output Voltage: 1.2V; Polarity: Positive; Output Voltage Accuracy: 2%; Quiescent Current: 260uA; Output Type: Adjustable; ComponentLink1URL: http://www.ti.com/lit/ds/symlink/tps796.pdf; ComponentLink1Description: TI datasheet online; Stock 1: 1314; Pricing 1: 1=3.16000, 10=2.83500, 25=2.67960, 100=2.20340, 250=1.97708, 500=1.90560, 1000=1.58403 (USD); RoHS: Yes; Case/Package: SOT-223; Number of Pins: 6; Contact Plating: Gold; Min Operating Temperature: -40°C; Max Operating Temperature: 125°C; Packaging: Tape and Reel; Package Quantity: 1; Max Output Current: 1A; Max Input Voltage: 5.5V; Number of Regulators: 1; Max Output Voltage: 5.5V; Accuracy: 2%; Radiation Hardening: No; REACH SVHC: No SVHC; Lead Free: Lead Free; Supplier Part Number 1: 296-13761-1-ND; Supplier Part Number 2: 3007966; Supplier Part Number 3: 595-TPS79601DCQR; Supplier 3: Mouser; Supplier 2: Farnell; Supplier 1: Digi-Key; Manufacturer Part Number: TPS79601DCQR
U4 = FSUSB42MUX: USB 2.0 multiplexer, 2 port; Manufacturer: ON Semiconductor / Fairchild; Number of Outputs: 4; Data Rate: 480Mbps; Number of Channels: 2; Operating Supply Voltage: 4.3V; Min Supply Voltage: 3V; On-State Resistance: 6.5R; Current: 100mA; Throw Configuration: DPDT; Supply Type: Single; ComponentLink1Description: online datasheet; ComponentLink1URL: https://www.onsemi.com/pub/Collateral/FSUSB42-D.PDF; Supplier 1: Digi-Key; Stock 1: 15860; Pricing 1: 1=0.62000, 10=0.54400, 100=0.38730, 500=0.31312, 1000=0.23896 (USD); RoHS: Yes; Mount: Surface Mount; Case/Package: MSOP; Number of Pins: 10; Weight: 0.1125g; Min Operating Temperature: -40°C; Max Operating Temperature: 85°C; Packaging: Tape and Reel; Package Quantity: 1; Number of Inputs: 2; Max Supply Voltage: 4.3V; Voltage: 4.3V; Length: 3mm; Height: 0.85mm; Width: 3mm; Radiation Hardening: No; REACH SVHC: No SVHC; Lead Free: Lead Free; Supplier 2: Farnell; Supplier 3: Mouser; Supplier 4: RSComponents; Supplier Part Number 1: FSUSB42MUXCT-ND; Supplier Part Number 2: 2564479; Supplier Part Number 3: 512-FSUSB42MUX; Supplier Part Number 4: 7395144; Manufacturer Part Number: FSUSB42MUX
U5 = MCP4018T-502E/LT: I2C digital pot 5k, single, 7 bit, 6SC70; Manufacturer: Microchip; Resistance: 5kR; Memory Type: Volatile; Number of Positions: 128; Interface: I2C,Serial,2-Wire; Max Supply Voltage: 5.5V; Min Supply Voltage: 1.8V; Tolerance: 20%; Nominal Supply Current: 2.5uA; Number of Circuits: 1; Temperature Coefficient: 150ppm/°C; ComponentLink1Description: Microchip datasheet online; ComponentLink1URL: http://ww1.microchip.com/downloads/en/DeviceDoc/22147a.pdf; Supplier 1: Digi-Key; Stock 1: 3653; Pricing 1: 1=0.51000, 25=0.43000 (USD); RoHS: Yes; Mount: Surface Mount; Case/Package: SC; Number of Pins: 6; Min Operating Temperature: -40°C; Max Operating Temperature: 125°C; Packaging: Tape and Reel; Package Quantity: 3000; Number of Taps: 128; Number of Elements: 1; Length: 2mm; Height: 1mm; Width: 1.25mm; Radiation Hardening: No; REACH SVHC: No SVHC; Lead Free: Lead Free; Supplier 2: Farnell; Supplier 3: Mouser; Supplier Part Number 1: MCP4018T-502E/LTCT-ND; Supplier Part Number 2: 1800210; Supplier Part Number 3: 579-MCP4018T502ELT; Manufacturer Part Number: MCP4018T-502E/LT
U6 U? = ADS1115IDGST: IC ADC 16-BIT I2C PROGBL 10-MSOP; Manufacturer: Texas Instruments (TI); Resolution: 16 Bit; Sampling Rate: 860 sps; Number of ADCs: 1; Number of Analog Inputs: 4|2; Architecture: Delta-Sigma; Digital Interface Type: Serial (2-Wire, I2C); Input Type: Voltage; Polarity of Input Voltage: Bipolar; Maximum Single Supply Voltage: 5.5 V; Typical Single Supply Voltage: 3.3 V; Voltage Supply Source: Single; Sample and Hold: No; Minimum Single Supply Voltage: 2 V; Typical Power Dissipation: 0.9 mW; Input Voltage: 4.096 V; Input Signal Type: Single-Ended|Differential; Integral Nonlinearity Error: 1 LSB; Single-Ended Input: Yes; Full Scale Error: 0.15 % of FSR; Lead Finish: Gold; Max Processing Temp: 260; Voltage Reference: Internal; Supplier 1: Digikey; Manufacturer Part Number: ADS1115IDGST; Stock 1: 6232; Pricing 1: 1=6.51, 10=5.847, 100=4.7903 (USD); Package: 10VSSOP; Category: ADC; Operating Temperature: -40 to 125 C; Mounting: Surface Mount; Digital Supply Support: No; Differential Input: Yes; Supplier Part Number 1: 296-24934-1-ND; ComponentLink1Description: online datasheet; ComponentLink1URL: http://www.ti.com/lit/ds/symlink/ads1115.pdf
U7 = CAT24C32WI-GT3: I2C serial EEPROM 32 kbit; Manufacturer: ON Semiconductor; Interface: I2C,Serial,2-Wire; Frequency: 400kHz; Min Supply Voltage: 1.7V; Max Supply Voltage: 5.5V; Access Time: 3500ns; Nominal Supply Current: 2mA; Density: 32Kb; Number of Words: 4096; Operating Supply Voltage: 5V; Max Frequency: 100kHz; Supplier 1: Digi-Key; Stock 1: 37111; Pricing 1: 1=0.200000, 10=0.197000, 100=0.161900, 500=0.157360, 1000=0.153150 (USD); RoHS: Yes; Mount: Surface Mount; Case/Package: SOIC; Number of Pins: 8; Contact Plating: Gold; Min Operating Temperature: -40°C; Max Operating Temperature: 85°C; Package Quantity: 1; Packaging: Tape and Reel; Memory Type: EEPROM; Memory Size: 32Kb; Length: 5mm; Height: 1.5mm; Width: 4mm; Radiation Hardening: No; Lead Free: Lead Free; REACH SVHC: No SVHC; Halogen Free: Halogen Free; Supplier 2: Farnell; Supplier 3: Mouser; Supplier 4: RSComponents; Supplier Part Number 1: CAT24C32WI-GT3CT-ND; Supplier Part Number 2: 2306646; Supplier Part Number 3: 698-CAT24C32WI-GT3; Supplier Part Number 4: 7814828; ComponentLink1Description: On Semi datasheet online; ComponentLink1URL: https://www.onsemi.com/pub/Collateral/CAT24C32-D.PDF

## Nets that join several sheets
3V3: ArcadeTestHAT 05 MCU (11 pins), ArcadeTestHAT 05 Pi interface (14 pins)
6V: ArcadeTestHAT 05 MCU (Q8.2 R1.1), ArcadeTestHAT 05 Pi interface (J7.1)
GND: ArcadeTestHAT 05 MCU (41 pins), ArcadeTestHAT 05 Pi interface (49 pins)
JD_POWER: ArcadeTestHAT 05 MCU (7 pins), ArcadeTestHAT 05 Pi interface (D9.2 U6.6)
JD_POWER2: ArcadeTestHAT 05 MCU (D7.1 J3.3 R4.2), ArcadeTestHAT 05 Pi interface (U6.7)
MCU_BOOT0: ArcadeTestHAT 05 MCU (R3#1.1 U1.44), ArcadeTestHAT 05 Pi interface (J18.2)
MCU_LED: ArcadeTestHAT 05 MCU (U1.39), ArcadeTestHAT 05 Pi interface (R20.1)
MCU_RESET: ArcadeTestHAT 05 MCU (U1.7), ArcadeTestHAT 05 Pi interface (J19.2)
MCU_SWCLK: ArcadeTestHAT 05 MCU (U1.37), ArcadeTestHAT 05 Pi interface (J36.2)
MCU_SWDIO: ArcadeTestHAT 05 MCU (U1.34), ArcadeTestHAT 05 Pi interface (J34.2)
MCU_USB_N: ArcadeTestHAT 05 MCU (U1.32), ArcadeTestHAT 05 Pi interface (U4.8)
MCU_USB_P: ArcadeTestHAT 05 MCU (U1.33), ArcadeTestHAT 05 Pi interface (U4.9)
RPI_CE1: ArcadeTestHAT 05 MCU (U1.14), ArcadeTestHAT 05 Pi interface (J27.2)
RPI_MISO: ArcadeTestHAT 05 MCU (U1.16), ArcadeTestHAT 05 Pi interface (J23.2)
RPI_MOSI: ArcadeTestHAT 05 MCU (U1.17), ArcadeTestHAT 05 Pi interface (J2.7 J22.2)
RPI_SCLK: ArcadeTestHAT 05 MCU (U1.15), ArcadeTestHAT 05 Pi interface (J2.9 J25.2)